# Altium schematic sheet Ramp V1-4交流+微步進驅動器+電源.SCHDOC
size 381 x 241 mm
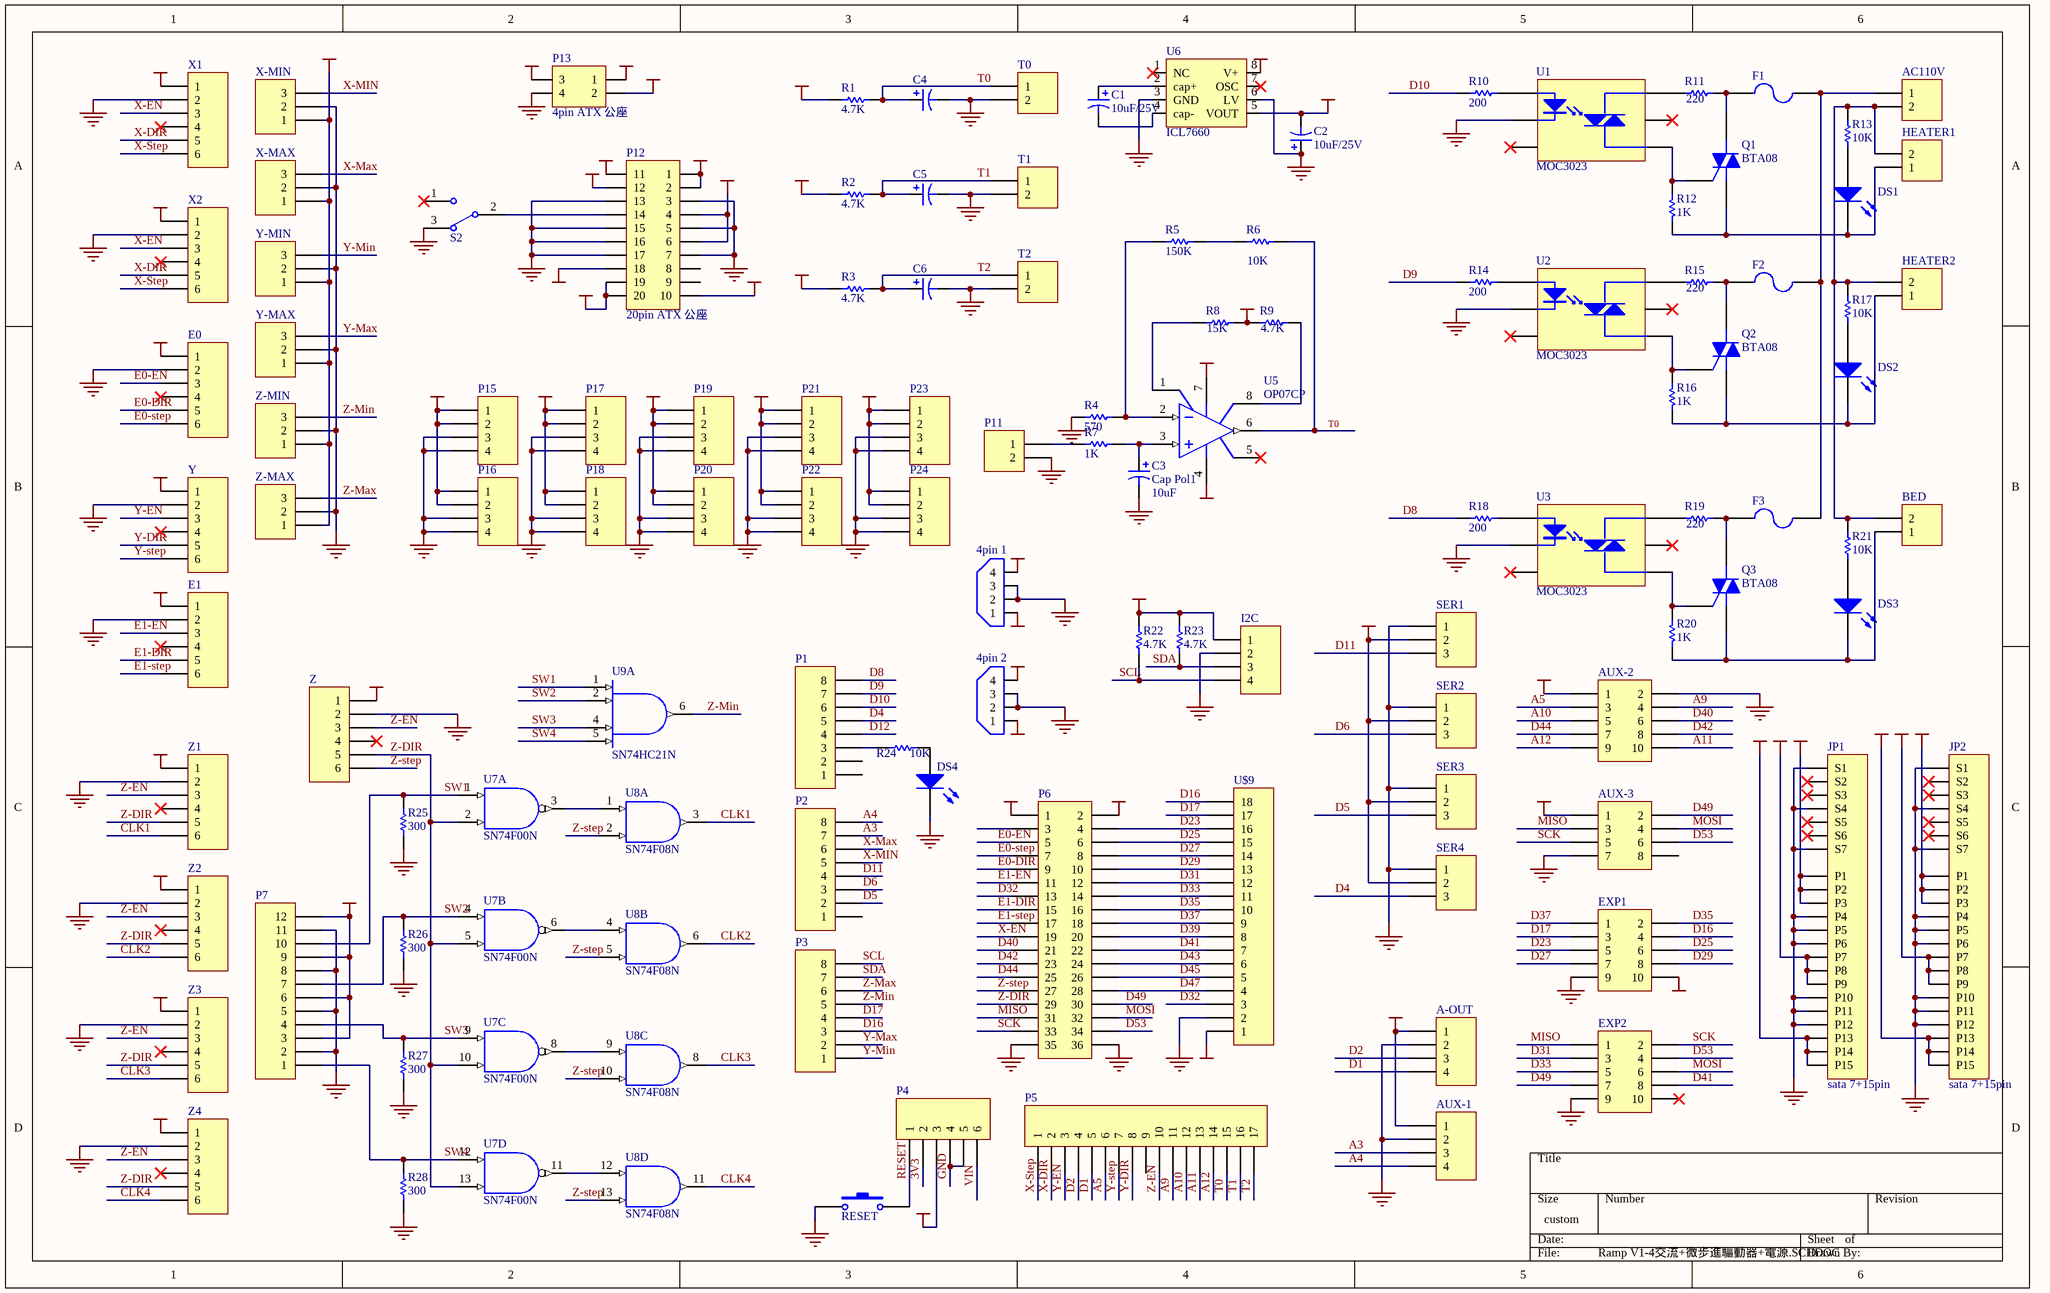
[diagram p0: Ramp V1-4交流+微步進驅動器+電源.SCHDOC]

## Parts
4pin_1  9090-4V  [9090-4V]  (value not drawn)
4pin_2  9090-4V  [9090-4V]  (value not drawn)
A-OUT  Header 4  [HDR1X4]  (value not drawn)
AC110V  Header 2  [2PIN端子-1]  (value not drawn)
AUX-1  Header 4  [HDR1X4]  (value not drawn)
AUX-2  Header 5X2  [HDR2X5]  (value not drawn)
AUX-3  Header 4X2  [HDR2X4]  (value not drawn)
BED  Header 2  [2PIN端子-1]  (value not drawn)
C1  value 10uF/25V  [CAPPR5-5x5]  (hidden comment: Cap Pol1)
C2  value 10uF/25V  [CAPPR5-5x5]  (hidden comment: Cap Pol1)
C3  Cap Pol1  value 10uF  [CAPPR5-5x5]
C4  Cap Pol1  [CAPPR2-5x6.8]  (value not drawn)
C5  Cap Pol1  [CAPPR2-5x6.8]  (value not drawn)
C6  Cap Pol1  [CAPPR2-5x6.8]  (value not drawn)
DS1  LED0  [LED-2]  (value not drawn)
DS2  LED0  [LED-2]  (value not drawn)
DS3  LED0  [LED-2]  (value not drawn)
DS4  LED0  [LED-2]  (value not drawn)
E0  Header 6  [HDR1X6]  (value not drawn)
E1  Header 6  [HDR1X6]  (value not drawn)
EXP1  Header 5X2  [10pin牛角公座]  (value not drawn)
EXP2  Header 5X2  [10pin牛角公座]  (value not drawn)
F1  Fuse 2  [保險絲座]  (value not drawn)
F2  Fuse 2  [保險絲座]  (value not drawn)
F3  Fuse 2  [保險絲座]  (value not drawn)
HEATER1  Header 2  [2PIN端子-1]  (value not drawn)
HEATER2  Header 2  [2PIN端子-1]  (value not drawn)
I2C  Header 4  [HDR1X4]  (value not drawn)
JP1  sata 7+15pin  [sata 7+15pin公座]
JP2  sata 7+15pin  [sata 7+15pin公座]
P1  Header 8  [HDR1X8]  (value not drawn)
P2  Header 8  [HDR1X8]  (value not drawn)
P3  Header 8  [HDR1X8]  (value not drawn)
P4  Header 6  [HDR1X6]  (value not drawn)
P5  Header 17  [HDR1X17]  (value not drawn)
P6  Header 18X2  [HDR2X18]  (value not drawn)
P7  Header 12  [2.5mm 90«× 12pin]  (value not drawn)
P11  Header 2  [2PIN端子¥x¦³¦Õ]  (value not drawn)
P12  20pin ATX 公座  [4.2mm 20pin]
P13  4pin ATX 公座  [4.2mm 4pin]
P15  Header 4  [HDR1X4]  (value not drawn)
P16  Header 4  [HDR1X4]  (value not drawn)
P17  Header 4  [HDR1X4]  (value not drawn)
P18  Header 4  [HDR1X4]  (value not drawn)
P19  Header 4  [HDR1X4]  (value not drawn)
P20  Header 4  [HDR1X4]  (value not drawn)
P21  Header 4  [HDR1X4]  (value not drawn)
P22  Header 4  [HDR1X4]  (value not drawn)
P23  Header 4  [HDR1X4]  (value not drawn)
P24  Header 4  [HDR1X4]  (value not drawn)
Q1  BTA08  [SFM-T3/X1.6V]
Q2  BTA08  [SFM-T3/X1.6V]
Q3  BTA08  [SFM-T3/X1.6V]
R1  value 4.7K  [AXIAL-0.3]  (hidden comment: Res1)
R2  value 4.7K  [AXIAL-0.3]  (hidden comment: Res1)
R3  value 4.7K  [AXIAL-0.3]  (hidden comment: Res1)
R4  value 570  [AXIAL-0.3]  (hidden comment: Res1)
R5  value 150K  [AXIAL-0.3]  (hidden comment: Res1)
R6  value 10K  [AXIAL-0.3]  (hidden comment: Res1)
R7  value 1K  [AXIAL-0.3]  (hidden comment: Res1)
R8  value 15K  [AXIAL-0.3]  (hidden comment: Res1)
R9  value 4.7K  [AXIAL-0.3]  (hidden comment: Res1)
R10  value 200  [AXIAL-0.4]  (hidden comment: Res1)
R11  value 220  [AXIAL-0.7]  (hidden comment: Res1)
R12  value 1K  [AXIAL-0.6]  (hidden comment: Res1)
R13  value 10K  [AXIAL-0.3]  (hidden comment: Res1)
R14  value 200  [AXIAL-0.4]  (hidden comment: Res1)
R15  value 220  [AXIAL-0.7]  (hidden comment: Res1)
R16  value 1K  [AXIAL-0.6]  (hidden comment: Res1)
R17  value 10K  [AXIAL-0.3]  (hidden comment: Res1)
R18  value 200  [AXIAL-0.4]  (hidden comment: Res1)
R19  value 220  [AXIAL-0.7]  (hidden comment: Res1)
R20  value 1K  [AXIAL-0.6]  (hidden comment: Res1)
R21  value 10K  [AXIAL-0.3]  (hidden comment: Res1)
R22  value 4.7K  [AXIAL-0.3]  (hidden comment: Res1)
R23  value 4.7K  [AXIAL-0.3]  (hidden comment: Res1)
R24  value 10K  [AXIAL-0.3]  (hidden comment: Res1)
R25  value 300  [AXIAL-0.3]  (hidden comment: Res1)
R26  value 300  [AXIAL-0.3]  (hidden comment: Res1)
R27  value 300  [AXIAL-0.3]  (hidden comment: Res1)
R28  value 300  [AXIAL-0.3]  (hidden comment: Res1)
RESET  SW-PB  [SW DIP4-2]  (value not drawn)
S2  SW3  [SW3-3]  (value not drawn)
SER1  Header 3  [HDR1X3]  (value not drawn)
SER2  Header 3  [HDR1X3]  (value not drawn)
SER3  Header 3  [HDR1X3]  (value not drawn)
SER4  Header 3  [HDR1X3]  (value not drawn)
T0  Header 2  [HDR1X2]  (value not drawn)
T1  Header 2  [HDR1X2]  (value not drawn)
T2  Header 2  [HDR1X2]  (value not drawn)
U1  MOC3023  [DIP-6]
U2  MOC3023  [DIP-6]
U3  MOC3023  [DIP-6]
U5  OP07CP  [DIP-8]
U6  ICL7660  [DIP-8]
U7  SN74F00N  [N014]  (parts A,B,C,D of 4)
U8  SN74F08N  [N014]  (parts A,B,C,D of 4)
U9  SN74HC21N  [N014]  (part A of 2)
U$9  Header 18  [HDR1X18]  (value not drawn)
X1  Header 6  [HDR1X6]  (value not drawn)
X2  Header 6  [HDR1X6]  (value not drawn)
X-MAX  Header 3  [2.5mm 3pin-2]  (value not drawn)
X-MIN  Header 3  [2.5mm 3pin-2]  (value not drawn)
Y  Header 6  [HDR1X6]  (value not drawn)
Y-MAX  Header 3  [2.5mm 3pin-2]  (value not drawn)
Y-MIN  Header 3  [2.5mm 3pin-2]  (value not drawn)
Z  Header 6  [HDR1X6]  (value not drawn)
Z1  Header 6  [HDR1X6]  (value not drawn)
Z2  Header 6  [HDR1X6]  (value not drawn)
Z3  Header 6  [HDR1X6]  (value not drawn)
Z4  Header 6  [HDR1X6]  (value not drawn)
Z-MAX  Header 3  [2.5mm 3pin-2]  (value not drawn)
Z-MIN  Header 3  [2.5mm 3pin-2]  (value not drawn)

## Nets
+3-3: JP1.P1 JP1.P2 JP1.P3 JP2.P1 JP2.P2 JP2.P3 P12.1 P12.2 P12.11 P13.2
+12: 4pin_1.4 4pin_2.4 JP1.P13 JP1.P14 JP1.P15 JP2.P13 JP2.P14 JP2.P15 P12.10 P13.1 P15.1 P15.2 P16.1 P16.2 P17.1 P17.2 P18.1 P18.2 P19.1 P19.2 P20.1 P20.2 P21.1 P21.2 P22.1 P22.2 P23.1 P23.2 P24.1 P24.2
-5: C2.2 P12.18 U5.4(V-) U6.5(VOUT)
-12: P12.12
GND: 4pin_1.2 4pin_1.3 4pin_2.2 4pin_2.3 A-OUT.2 AUX-1.2 AUX-2.2 AUX-3.7 C2.1 C3.2 C4.2 C5.2 C6.2 DS4.2(K) E0.2 E1.2 EXP1.9 EXP2.9 I2C.2 JP1.P4 JP1.P5 JP1.P6 JP1.P10 JP1.P11 JP1.P12 JP1.S1 JP1.S4 JP1.S7 JP2.P4 JP2.P5 JP2.P6 JP2.P10 JP2.P11 JP2.P12 JP2.S1 JP2.S4 JP2.S7 P4.4 P4.5 P6.35 P6.36 P7.2 P7.5 P7.8 P7.11 P11.2 P12.3 P12.5 P12.7 P12.13 P12.15 P12.16 P12.17 P13.4 P15.3 P15.4 P16.3 P16.4 P17.3 P17.4 P18.3 P18.4 P19.3 P19.4 P20.3 P20.4 P21.3 P21.4 P22.3 P22.4 P23.3 P23.4 P24.3 P24.4 R4.1 R25.1 R26.1 R27.1 R28.1 RESET.2 S2.3 SER1.1 SER2.1 SER3.1 SER4.1 T0.2 T1.2 T2.2 U1.2(C) U2.2(C) U3.2(C) U6.3(GND) U6.6(LV) U7.7(GND) U8.7(GND) U9.7(GND) U$9.2 X1.2 X2.2 X-MAX.2 X-MIN.2 Y.2 Y-MAX.2 Y-MIN.2 Z.2 Z1.2 Z2.2 Z3.2 Z4.2 Z-MAX.2 Z-MIN.2
VCC: 4pin_1.1 4pin_2.1 A-OUT.1 AUX-1.1 AUX-2.1 AUX-3.1 E0.1 E1.1 EXP1.10 I2C.1 JP1.P7 JP1.P8 JP1.P9 JP2.P7 JP2.P8 JP2.P9 P4.3 P6.1 P6.2 P7.3 P7.6 P7.9 P7.12 P12.4 P12.6 P12.19 P12.20 P13.3 R1.1 R2.1 R3.1 R8.2 R9.1 R22.2 R23.2 SER1.2 SER2.2 SER3.2 SER4.2 U5.7(V+) U6.8(V+) U7.14(VCC) U8.14(VCC) U9.14(VCC) U$9.1 X1.1 X2.1 X-MAX.1 X-MIN.1 Y.1 Y-MAX.1 Y-MIN.1 Z.1 Z1.1 Z2.1 Z3.1 Z4.1 Z-MAX.1 Z-MIN.1
3V3: P4.2
A3: AUX-1.3 P2.7
A4: AUX-1.4 P2.8
A5: AUX-2.3 P5.6
A9: AUX-2.4 P5.11
A10: AUX-2.5 P5.12
A11: AUX-2.10 P5.13
A12: AUX-2.9 P5.14
CLK1: U8.3(Y) Z1.6
CLK2: U8.6(Y) Z2.6
CLK3: U8.8(Y) Z3.6
CLK4: U8.11(Y) Z4.6
D1: A-OUT.4 P5.5
D2: A-OUT.3 P5.4
D4: P1.5 SER4.3
D5: P2.2 SER3.3
D6: P2.3 SER2.3
D8: P1.8 R18.1
D9: P1.7 R14.1
D10: P1.6 R10.1
D11: P2.4 SER1.3
D12: P1.4
D16: EXP1.4 P3.3 U$9.18
D17: EXP1.3 P3.4 U$9.17
D23: EXP1.5 P6.4 U$9.16
D25: EXP1.6 P6.6 U$9.15
D27: EXP1.7 P6.8 U$9.14
D29: EXP1.8 P6.10 U$9.13
D31: EXP2.3 P6.12 U$9.12
D32: P6.13 U$9.3
D33: EXP2.5 P6.14 U$9.11
D35: EXP1.2 P6.16 U$9.10
D37: EXP1.1 P6.18 U$9.9
D39: P6.20 U$9.8
D40: AUX-2.6 P6.21
D41: EXP2.8 P6.22 U$9.7
D42: AUX-2.8 P6.23
D43: P6.24 U$9.6
D44: AUX-2.7 P6.25
D45: P6.26 U$9.5
D47: P6.28 U$9.4
D49: AUX-3.2 EXP2.7 P6.30
D53: AUX-3.6 EXP2.4 P6.34
E0-DIR: E0.5 P6.9
E0-EN: E0.3 P6.5
E0-step: E0.6 P6.7
E1-DIR: E1.5 P6.15
E1-EN: E1.3 P6.11
E1-step: E1.6 P6.17
MISO: AUX-3.3 EXP2.1 P6.31
MOSI: AUX-3.4 EXP2.6 P6.32
RESET: P4.1 RESET.1
SCK: AUX-3.5 EXP2.2 P6.33
SCL: I2C.4 P3.8 R22.1
SDA: I2C.3 P3.7 R23.1
SW1: P7.10 R25.2 U7.1(A) U9.1(A)
SW2: P7.7 R26.2 U7.4(A) U9.2(B)
SW3: P7.4 R27.2 U7.9(A) U9.4(C)
SW4: P7.1 R28.2 U7.12(A) U9.5(D)
T0: C4.1 P5.15 R1.2 R6.2 T0.1 U5.6(OUT)
T1: C5.1 P5.16 R2.2 T1.1
T2: C6.1 P5.17 R3.2 T2.1
VIN: P4.6
X-DIR: P5.2 X1.5 X2.5
X-EN: P6.19 X1.3 X2.3
X-Max: P2.6 X-MAX.3
X-MIN: P2.5 X-MIN.3
X-Step: P5.1 X1.6 X2.6
Y-DIR: P5.8 Y.5
Y-EN: P5.3 Y.3
Y-Max: P3.2 Y-MAX.3
Y-Min: P3.1 Y-MIN.3
Y-step: P5.7 Y.6
Z-DIR: P6.29 U7.2(B) U7.5(B) U7.10(B) U7.13(B) Z.5 Z1.5 Z2.5 Z3.5 Z4.5
Z-EN: P5.10 Z.3 Z1.3 Z2.3 Z3.3 Z4.3
Z-Max: P3.6 Z-MAX.3
Z-Min: P3.5 U9.6(Y) Z-MIN.3
Z-step: P6.27 U8.2(B) U8.5(B) U8.10(B) U8.13(B) Z.6
NetAC110V_1: AC110V.1 F1.2 F2.2 F3.2
NetAC110V_2: AC110V.2 BED.2 HEATER1.2 HEATER2.2 R13.2 R17.2 R21.2
NetBED_1: BED.1 DS3.2(K) Q3.1(M1) R20.1
NetC1_1: C1.1 U6.2(cap+)
NetC1_2: C1.2 U6.4(cap-)
NetC3_1: C3.1 R7.2 U5.3(IN+)
NetDS1_1: DS1.1(A) R13.1
NetDS1_2: DS1.2(K) HEATER1.1 Q1.1(M1) R12.1
NetDS2_1: DS2.1(A) R17.1
NetDS2_2: DS2.2(K) HEATER2.1 Q2.1(M1) R16.1
NetDS3_1: DS3.1(A) R21.1
NetDS4_1: DS4.1(A) R24.1
NetF1_1: F1.1 Q1.2(M2) R11.2
NetF2_1: F2.1 Q2.2(M2) R15.2
NetF3_1: F3.1 Q3.2(M2) R19.2
NetP1_3: P1.3 R24.2
NetP11_1: P11.1 R7.1
NetP12_14: P12.14 S2.2
NetQ1_3: Q1.3(G) R12.2 U1.4(main_terminal)
NetQ2_3: Q2.3(G) R16.2 U2.4(main_terminal)
NetQ3_3: Q3.3(G) R20.2 U3.4(main_terminal)
NetR4_2: R4.2 R5.1 U5.2(IN-)
NetR5_2: R5.2 R6.1
NetR8_1: R8.1 U5.1(VOSTRIM)
NetR9_2: R9.2 U5.8(VOSTRIM)
NetR10_2: R10.2 U1.1(A)
NetR11_1: R11.1 U1.6(main_terminal)
NetR14_2: R14.2 U2.1(A)
NetR15_1: R15.1 U2.6(main_terminal)
NetR18_2: R18.2 U3.1(A)
NetR19_1: R19.1 U3.6(main_terminal)
NetU7_3: U7.3(Y) U8.1(A)
NetU7_6: U7.6(Y) U8.4(A)
NetU7_8: U7.8(Y) U8.9(A)
NetU7_11: U7.11(Y) U8.12(A)

Not connected (* = marked no-connect by the designer): AUX-3 8; E0 4*; E1 4*; EXP2 10*; JP1 S2* S3* S5* S6*; JP2 S2* S3* S5* S6*; P1 1 2; P2 1; P5 9; P6 3; P12 8 9; S2 1*; U1 3(NC)* 5(NC)*; U2 3(NC)* 5(NC)*; U3 3(NC)* 5(NC)*; U5 5(NC)*; U6 1(NC)* 7(OSC)*; X1 4*; X2 4*; Y 4*; Z 4*; Z1 4*; Z2 4*; Z3 4*; Z4 4*

## Library data of the parts
A-OUT AUX-1 I2C P15-P24 = Header 4: Header, 4-Pin; LatestRevisionDate: 17-Jul-2002; LatestRevisionNote: Re-released for DXP Platform.; Publisher: Altium Limited
AC110V BED HEATER1 HEATER2 P11 T0-T2 = Header 2: Header, 2-Pin; LatestRevisionDate: 17-Jul-2002; LatestRevisionNote: Re-released for DXP Platform.; Publisher: Altium Limited
AUX-2 EXP1 EXP2 = Header 5X2: Header, 5-Pin, Dual row; LatestRevisionDate: 17-Jul-2002; LatestRevisionNote: Re-released for DXP Platform.; Publisher: Altium Limited
AUX-3 = Header 4X2: Header, 4-Pin, Dual row; LatestRevisionDate: 17-Jul-2002; LatestRevisionNote: Re-released for DXP Platform.; Publisher: Altium Limited
C1-C6 = Cap Pol1: Polarized Capacitor (Radial); Published: 8-Jun-2000; LatestRevisionDate: 17-Jul-2002; LatestRevisionNote: Re-released for DXP Platform.; Publisher: Altium Limited
DS1-DS4 = LED0: Typical INFRARED GaAs LED; Published: 8-Jun-2000; LatestRevisionDate: 17-Jul-2002; LatestRevisionNote: Re-released for DXP Platform.; Publisher: Altium Limited
E0 E1 P4 X1 X2 Y Z Z1-Z4 = Header 6: Header, 6-Pin; LatestRevisionDate: 17-Jul-2002; LatestRevisionNote: Re-released for DXP Platform.; Publisher: Altium Limited
F1-F3 = Fuse 2: Fuse; Published: 8-Jun-2000; LatestRevisionDate: 17-Jul-2002; LatestRevisionNote: Re-released for DXP Platform.; Publisher: Altium Limited
P1-P3 = Header 8: Header, 8-Pin; LatestRevisionDate: 17-Jul-2002; LatestRevisionNote: Re-released for DXP Platform.; Publisher: Altium Limited
P5 = Header 17: Header, 17-Pin; LatestRevisionDate: 17-Jul-2002; LatestRevisionNote: Re-released for DXP Platform.; Publisher: Altium Limited
P6 = Header 18X2: Header, 18-Pin, Dual row; LatestRevisionDate: 17-Jul-2002; LatestRevisionNote: Re-released for DXP Platform.; Publisher: Altium Limited
P7 = Header 12: Header, 12-Pin; LatestRevisionDate: 17-Jul-2002; LatestRevisionNote: Re-released for DXP Platform.; Publisher: Altium Limited
Q1-Q3 = Triac: Silicon Bidirectional Triode Thyristor; Note: Pin 2 is electrically connected to Pin 4 (TAB); Published: 29-Sep-2000; LatestRevisionDate: 17-Jul-2002; LatestRevisionNote: Re-released for DXP Platform.; DatasheetDocument: 1999; PackageReference: 221A-09; Publisher: Altium Limited; Code_JEDEC: TO-251-AA
R1-R28 = Res1: Resistor; Published: 8-Jun-2000; LatestRevisionDate: 17-Jul-2002; LatestRevisionNote: Re-released for DXP Platform.; Publisher: Altium Limited
RESET = SW-PB: Switch; Published: 24-Mar-1999; LatestRevisionDate: 17-Jul-2002; LatestRevisionNote: Re-released for DXP Platform.; Publisher: Altium Limited
S2 = SW3: SPDT Subminiature Toggle Switch, Right Angle Mounting, Vertical Actuation; Revision 1: Jul-2002: Re-released for DXP Platform.; Revision 2: 17-Dec-2003: Schematic revised, PCB Footprint replaced.; Published: 24-Mar-1999; Datasheet: Latest Revision: 05-Dec-2000; Publisher: Altium Limited
SER1-SER4 X-MAX X-MIN Y-MAX Y-MIN Z-MAX Z-MIN = Header 3: Header, 3-Pin; LatestRevisionDate: 17-Jul-2002; LatestRevisionNote: Re-released for DXP Platform.; Publisher: Altium Limited
U5 = OP07CP: Ultra-Low Offset Voltage Operational Amplifier; Note: Pin 5 is not connected.; Published: 8-Jun-2000; LatestRevisionDate: 17-Jul-2002; LatestRevisionNote: Re-released for DXP Platform.; DatasheetDocument: 1992; PackageReference: N-8_A; Publisher: Altium Limited; Code_JEDEC: MO-001-AN
U7 = SN74F00N: Quadruple 2-Input Positive-NAND Gate; Published: 8-Jun-2000; LatestRevisionDate: 17-Jul-2002; LatestRevisionNote: Re-released for DXP Platform.; DatasheetDocument: Oct-1993; PackageDocument: Oct-1995; PackageReference: N014; Publisher: Altium Limited
U8 = SN74F08N: Quadruple 2-Input Positive-AND Gate; Published: 8-Jun-2000; LatestRevisionDate: 17-Jul-2002; LatestRevisionNote: Re-released for DXP Platform.; DatasheetDocument: Oct-1993; PackageDocument: Oct-1995; PackageReference: N014; Publisher: Altium Limited
U9 = SN74HC21N: Dual 4-Input Positive-AND Gate; Note: Pins 3 and 11 are not connected and not drawn; Published: 8-Jun-2000; LatestRevisionDate: 17-Jul-2002; LatestRevisionNote: Re-released for DXP Platform.; DatasheetDocument: May-1997; PackageDocument: Oct-1995; PackageReference: N014; Publisher: Altium Limited
U$9 = Header 18: Header, 18-Pin; LatestRevisionDate: 17-Jul-2002; LatestRevisionNote: Re-released for DXP Platform.; Publisher: Altium Limited